# Altium schematic sheet Boost-to-12V.SchDoc
size 292 x 193 mm; Author: Power Lin; SheetNumber: 1; SheetTotal: 1; Website: wiki-power.com
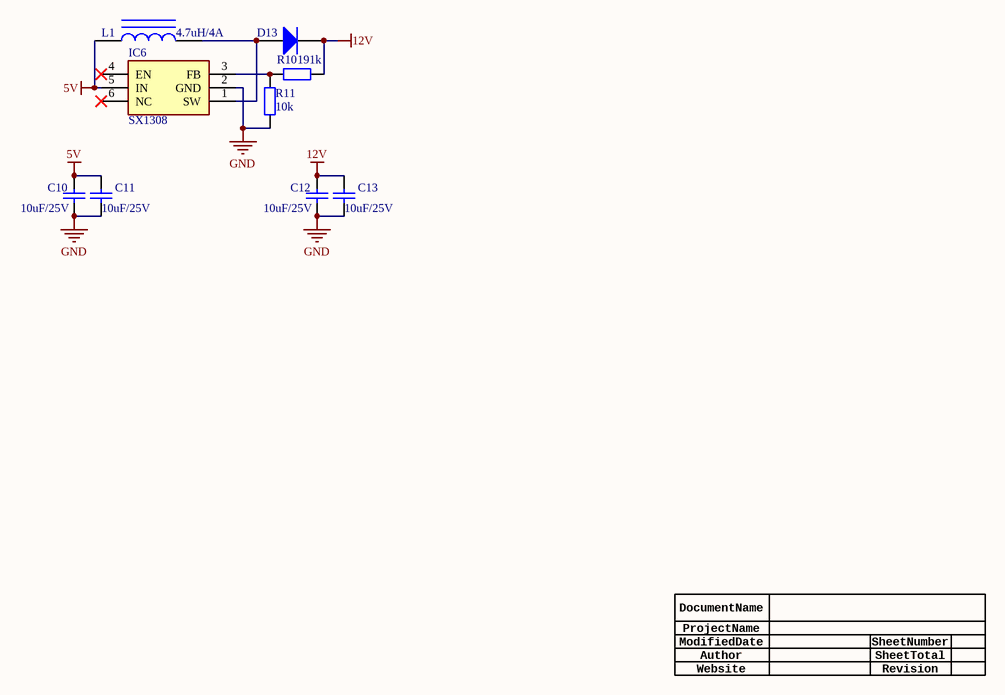
[diagram p0: Boost-to-12V.SchDoc]

## Parts
C10  10uF/25V  [CAP-0603]
C11  10uF/25V  [CAP-0603]
C12  10uF/25V  [CAP-0603]
C13  10uF/25V  [CAP-0603]
D13  SS34  [DO-214AC/SMA]  (value not drawn)
IC6  SX1308  [SOT-23-6]
L1  4.7uH/4A  [SMD_7.3x7.3x4.2mm]
R10  191k  [R-0603]
R11  10k  [R-0603]

## Nets
5V: C10.2 C11.2 IC6.5(IN) L1.1
12V: C12.2 C13.2 D13.2(K) R10.2
GND: C10.1 C11.1 C12.1 C13.1 IC6.2(GND) R11.1
NetD13_1: D13.1(A) IC6.1(SW) L1.2
NetIC6_3: IC6.3(FB) R10.1 R11.2

Not connected (* = marked no-connect by the designer): IC6 4(EN)* 6(NC)*

## Notes on the sheet
- Author
- DocumentName
- ModifiedDate
- ProjectName
- SheetNumber
- SheetTotal
- Website
- Revision

## Library data of the parts
C10-C13 = CAP: X7R; ComponentLink1Description: 供应商链接; ComponentLink1URL: http://www.szlcsc.com/product/details_53938.html; Package: 0402; Supplier: LC; SuppliersPartNumber: C52923
D13 = DIODE: 二极管; ComponentLink1Description: 供应商链接; ComponentLink1URL: http://www.szlcsc.com/product/details_23178.html; Package: SMA(DO-214AC); Supplier: LC; SuppliersPartNumber: C22452
IC6 = SX1308: 集成升压芯片; Manufacturer_Name: Shenzhen Suosemi Tech; Datasheet Link: https://datasheet.lcsc.com/szlcsc/Shenzhen-Suosemi-Tech-SX1308_C78162.pdf; Height: 1.45mm; Manufacturer_Part_Number: SX1308
L1 = INDUCTOR: 电感; ComponentLink1Description: 供应商链接; ComponentLink1URL: http://www.szlcsc.com/product/details_33003.html; Package: 0402; Supplier: LC; SuppliersPartNumber: C32041
R10 R11 = RES: 贴片电阻; Package: 0805; Supplier: LC; SuppliersPartNumber: C17798